# EAGLE schematic CriCri-electrical-diagram (EAGLE 7.2.0)

## Sheet 1 of 2
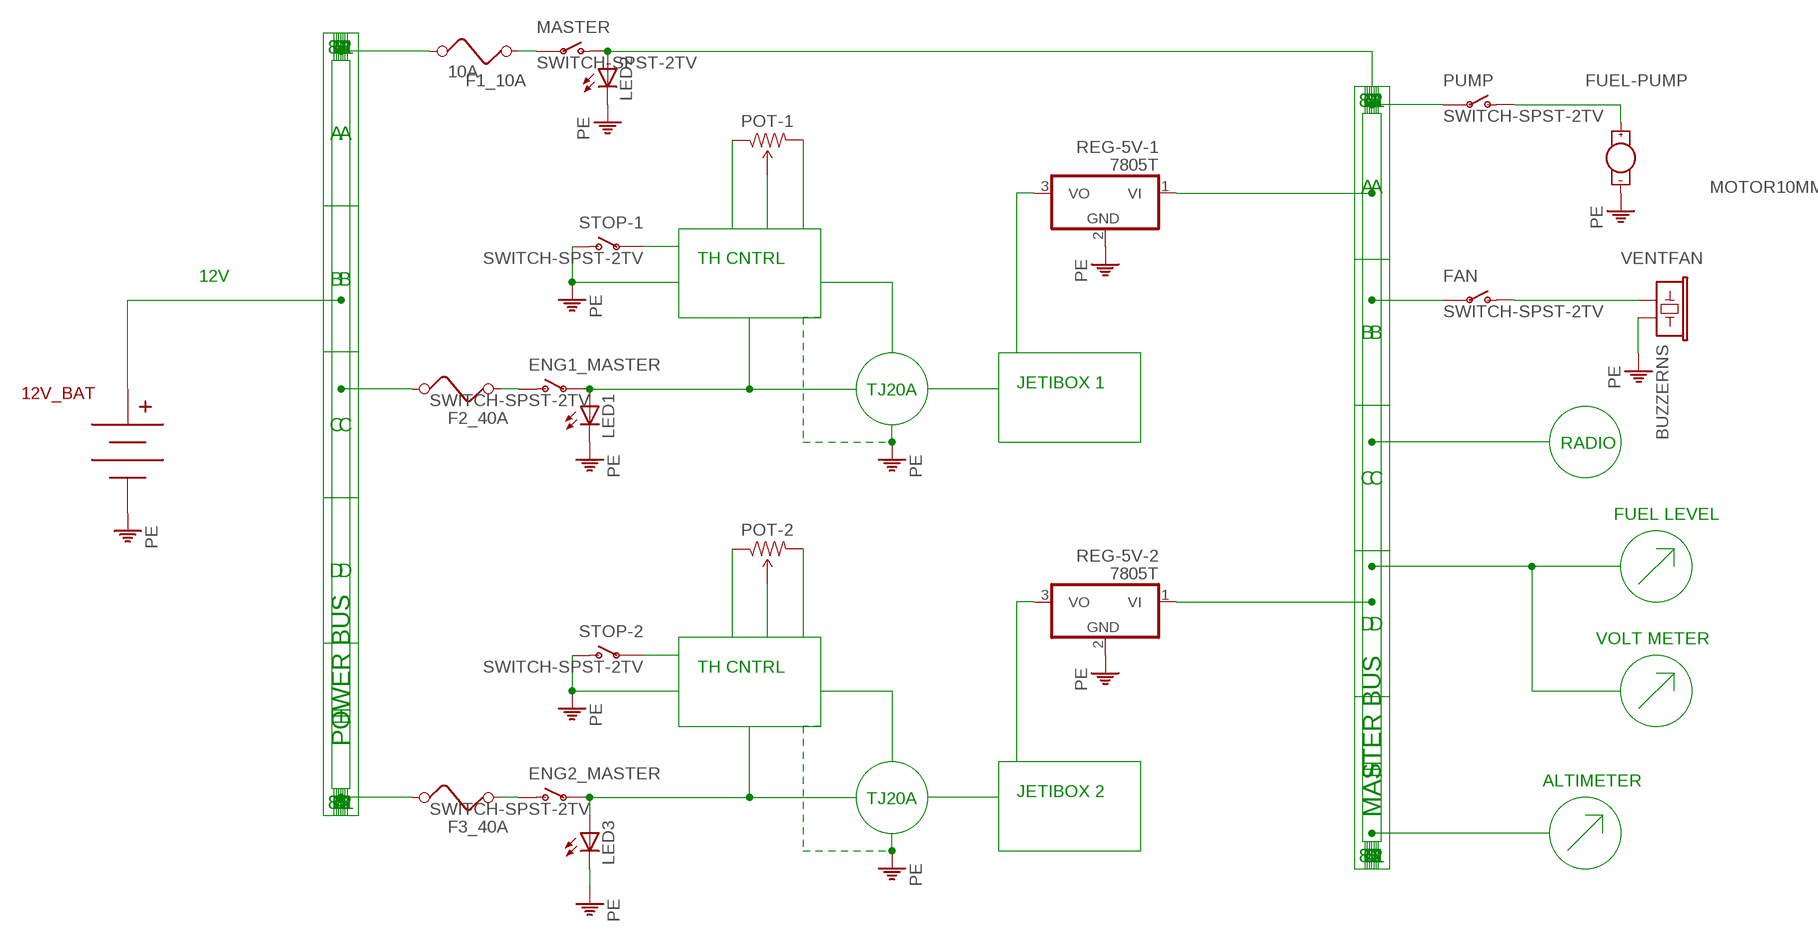
[diagram p0: schematic, sheet 1]

### Parts
12V_BAT  BC9VPC  [BC9VPC]
ENG1_MASTER  SWITCH-SPST-2TV  [SWITCH-SPST-VERTICAL]
ENG2_MASTER  SWITCH-SPST-2TV  [SWITCH-SPST-VERTICAL]
F1_10A  10A  FUSE  [FUSE]
F2_40A  FUSE  [FUSE]
F3_40A  FUSE  [FUSE]
FAN  SWITCH-SPST-2TV  [SWITCH-SPST-VERTICAL]
FUEL-PUMP  MOTOR10MM  [VIBE-MOTOR-10MM]
LED1  LEDB155  [Q62902-B155]
LED2  LEDB155  [Q62902-B155]
LED3  LEDB155  [Q62902-B155]
MASTER  SWITCH-SPST-2TV  [SWITCH-SPST-VERTICAL]
POT-1  TRIMPOT  [TRIMPOT-5MM-V2]
POT-2  TRIMPOT  [TRIMPOT-5MM-V2]
PUMP  SWITCH-SPST-2TV  [SWITCH-SPST-VERTICAL]
REG-5V-1  7805T  [TO220H]
REG-5V-2  7805T  [TO220H]
STOP-1  SWITCH-SPST-2TV  [SWITCH-SPST-VERTICAL]
STOP-2  SWITCH-SPST-2TV  [SWITCH-SPST-VERTICAL]
VENTFAN  BUZZERNS  [BUZZER-12MM-NS]

### Nets
N$1: F1_10A.2 MASTER.2(P)
N$2: REG-5V-1.3(VO)
N$3: FUEL-PUMP.+ PUMP.1(O)
N$4: FAN.1(O) VENTFAN.+
N$5: ENG1_MASTER.1(O) F2_40A.2
N$6: POT-1.B(WIPER) POT-1.C(CW)
N$7: REG-5V-2.3(VO)
N$8: POT-1.A(CCW)
N$14: 12V_BAT.V+
N$16: STOP-1.2(P)
N$17: ENG1_MASTER.2(P) LED1.A
N$18: LED2.A MASTER.1(O)
N$20: ENG2_MASTER.1(O) F3_40A.2
N$21: POT-2.B(WIPER) POT-2.C(CW)
N$22: POT-2.A(CCW)
N$23: STOP-2.2(P)
N$25: REG-5V-2.1(VI)
N$27: ENG2_MASTER.2(P) LED3.A
N$28: FAN.2(P)
N$30: REG-5V-1.1(VI)
N$31: PUMP.2(P)
N$37: F2_40A.1
N$38: F1_10A.1
PE: 12V_BAT.V- FUEL-PUMP.- LED1.K(C) LED2.K(C) LED3.K(C) REG-5V-1.2(GND) REG-5V-2.2(GND) STOP-1.1(O) STOP-2.1(O) VENTFAN.- ; also sheet 2
VCC2: F3_40A.1

### Notes on the sheet
- TH CNTRL
- 12V
- JETIBOX 1
- TJ20A
- RADIO
- FUEL LEVEL
- VOLT METER
- TH CNTRL
- POWER BUS
- ALTIMETER
- JETIBOX 2
- TJ20A
- MASTER BUS

## Sheet 2 of 2
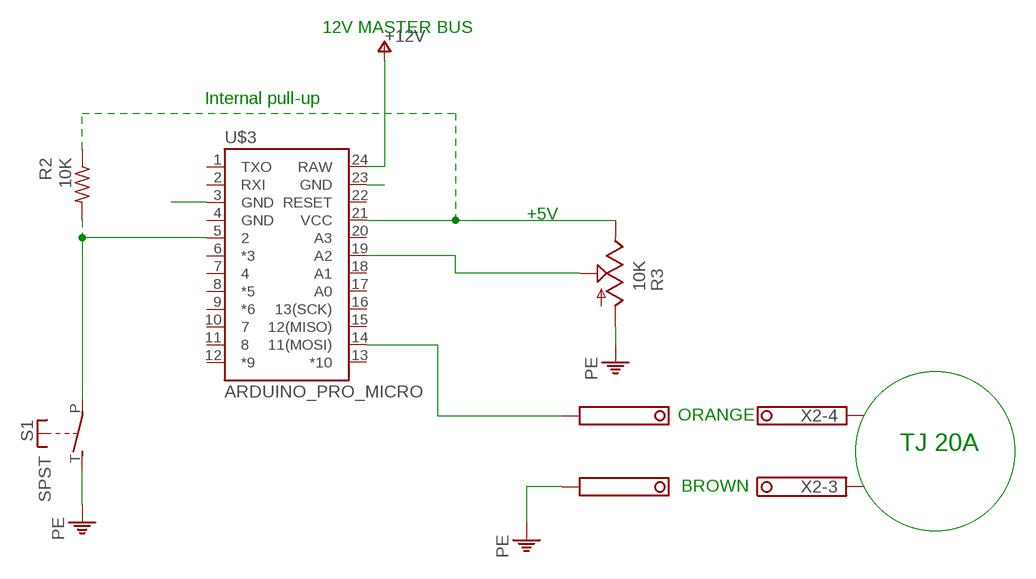
[diagram p1: schematic, sheet 2]

### Parts
R2  10K  R-US_0207/10  [0207/10]
R3  10K  TRIM_US-B25V  [B25V]
S1  SPST  [JUDCOSPST]
U$3  ARDUINO_PRO_MICRO  [ARDUINO_PRO_MICRO]
X1  1751277  [1751277]
X2  1751277  [1751277]

### Nets
GND [GND]: U$3.3(GND) X1.5 ; supply symbol labelled PE
N$9: R2.2 S1.P U$3.5
N$10: R3.S U$3.19(A2)
N$11: U$3.14(11(MOSI)) X1.1
N$12: U$3.23(GND)
N$13: R2.1 R3.E U$3.21(VCC)
PE: R3.A S1.T(S) ; also sheet 1
V+: U$3.24(RAW) ; supply symbol labelled +12V
Unconnected: U$3.1(TXO) U$3.2(RXI) U$3.4(GND) U$3.6(*3) U$3.7 U$3.8(*5) U$3.9(*6) U$3.10 U$3.11 U$3.12(*9) U$3.13(*10) U$3.15(12(MISO)) U$3.16(13(SCK)) U$3.17(A0) U$3.18(A1) U$3.20(A3) U$3.22(RESET) X1.2 X1.3 X1.4 X2.1 X2.2 X2.3 X2.4 X2.5

### Notes on the sheet
- 12V MASTER BUS
- Internal pull-up
- +5V
- ORANGE
- TJ 20A
- BROWN

## Library data of the parts
12V_BAT = SparkFun-Connectors:BC9VPC: 9V board-mount battery cradle; PROD_ID: BATT-10855
ENG1_MASTER ENG2_MASTER FAN MASTER PUMP STOP-1 STOP-2 = SparkFun-Electromechanical:SWITCH-SPST-2
F1_10A F2_40A F3_40A = special:FUSE: FUSE 5 x 20 mm
FUEL-PUMP = SparkFun-Electromechanical:MOTOR: Vibration Motor- ROB-08449 Physical dimension and wire connections for this powerful vibration motor. Motor has a self adhesive backing.
LED1-LED3 = adafruit:LED: LED OSRAM: - CHIPLED LG R971, LG N971, LY N971, LG Q971, LY Q971, LO R971, LY R971 LH N974, LH R974 LS Q976, LO Q976, LY Q976 LO Q996 - Hyper CHIPLED LW Q18S LB Q993, LB Q99A, LB R99A - SideLED LS A670, LO A670, LY A670, LG A670, LP A670 LB A673, LV A673, LT A673, LW A673 LH A674 LY A675 LS A676, LA A676, LO A676, LY A676, LW A676 LS A679, LY A679, LG A679 - Hyper Micro SIDELED® LS Y876, LA Y876, LO Y876, LY Y876 LT Y87S - SmartLED LW L88C, LW L88S LB L89C, LB L89S, LG L890 LS L89K, LO L89K, LY L89K LS L896, LA L896, LO L896, LY L896 - TOPLED LS T670, LO T670, LY T670, LG T670, LP T670 LSG T670, LSP T670, LSY T670, LOP T670, LYG T670 LG T671, LOG T671, LSG T671 LB T673, LV T673, LT T673, LW T673 LH T674 LS T676, LA T676, LO T676, LY T676, LB T676, LH T676, LSB T676, LW T676 LB T67C, LV T67C, LT T67C, LS T67K, LO T67K, LY T67K, LW E67C LS E67B, LA E67B, LO E67B, LY E67B, LB E67C, LV E67C, LT E67C LW T67C LS T679, LY T679, LG T679 LS T770, LO T770, LY T770, LG T770, LP T770 LB T773, LV T773, LT T773, LW T773 LH T774 LS E675, LA E675, LY E675, LS T675 LS T776, LA T776, LO T776, LY T776, LB T776 LHGB T686 LT T68C, LB T68C - Hyper Mini TOPLED® LB M676 - Mini TOPLED Santana® LG M470 LS M47K, LO M47K, LY M47K Source: http://www.osram.convergy.de/
POT-1 POT-2 = SparkFun-Electromechanical:TRIMPOT: Various small potentiometers for "set-and-forget" applications
R2 = resistor:R-US_: RESISTOR, American symbol
R3 = pot:TRIM_US-: POTENTIOMETER
REG-5V-1 REG-5V-2 = linear:78*: Positive VOLTAGE REGULATOR Source: http://cache.national.com/ds/LM/LM78L05.pdf http://www.fairchildsemi.com/ds/LM/LM7805.pdf
S1 = adafruit:SPST: Judco 50-0015-00
U$3 = SparkFun-Boards:ARDUINO_PRO_MICRO
VENTFAN = SparkFun-Electromechanical:BUZZER: Buzzer 12mm Spark Fun Electronics SKU : Comp-Buzzer
X1 X2 = con-phoenix-350:1751277: MKDS 1/ 5-3,5 Printklemme Nennstrom: 10 A Bemessungsspannung: 160 V Raster: 3,5 mm Polzahl: 5 Montageart: Löten Anschlussart: Schraubanschluss Anschlussrichtung vom Leiter zur Platine: 0° Source: http://eshop.phoenixcontact.com .. 1751277.pdf; OC_FARNELL: unknown; OC_NEWARK: unknown

## Module PWM
Ports: TH(io) PWM(io) GND(io) +12V(io)
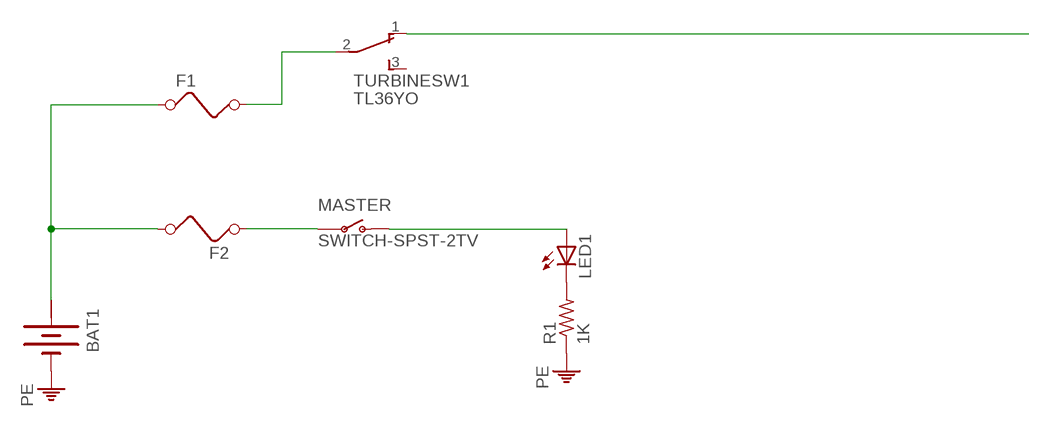
[diagram p2: schematic, module PWM, sheet 1]

### Parts
BAT1  BATTERY  [BATTERY]
F1  FUSE  [FUSE]
F2  FUSE  [FUSE]
LED1  LEDB155  [Q62902-B155]
MASTER  SWITCH-SPST-2TV  [SWITCH-SPST-VERTICAL]
R1  1K  R-US_0204/2V  [0204V]
TURBINESW1  TL36YO  [TL3XYO]

### Nets
N$1: F1.2 TURBINESW1.2(P)
N$2: TURBINESW1.1(O)
N$3: LED1.K(C) R1.2
N$4: F2.1 MASTER.2(P)
N$5: LED1.A MASTER.1(O)
N$6: BAT1.+ F1.1 F2.2
PE: BAT1.- R1.1
Unconnected: TURBINESW1.3(S)

### Power pins joined to a net without a drawn wire
+: BAT1.+@1(+)

### Library data of the parts
BAT1 = special:BATTERY: BATTERY
F1 F2 = special:FUSE: FUSE 5 x 20 mm
LED1 = adafruit:LED: LED OSRAM: - CHIPLED LG R971, LG N971, LY N971, LG Q971, LY Q971, LO R971, LY R971 LH N974, LH R974 LS Q976, LO Q976, LY Q976 LO Q996 - Hyper CHIPLED LW Q18S LB Q993, LB Q99A, LB R99A - SideLED LS A670, LO A670, LY A670, LG A670, LP A670 LB A673, LV A673, LT A673, LW A673 LH A674 LY A675 LS A676, LA A676, LO A676, LY A676, LW A676 LS A679, LY A679, LG A679 - Hyper Micro SIDELED® LS Y876, LA Y876, LO Y876, LY Y876 LT Y87S - SmartLED LW L88C, LW L88S LB L89C, LB L89S, LG L890 LS L89K, LO L89K, LY L89K LS L896, LA L896, LO L896, LY L896 - TOPLED LS T670, LO T670, LY T670, LG T670, LP T670 LSG T670, LSP T670, LSY T670, LOP T670, LYG T670 LG T671, LOG T671, LSG T671 LB T673, LV T673, LT T673, LW T673 LH T674 LS T676, LA T676, LO T676, LY T676, LB T676, LH T676, LSB T676, LW T676 LB T67C, LV T67C, LT T67C, LS T67K, LO T67K, LY T67K, LW E67C LS E67B, LA E67B, LO E67B, LY E67B, LB E67C, LV E67C, LT E67C LW T67C LS T679, LY T679, LG T679 LS T770, LO T770, LY T770, LG T770, LP T770 LB T773, LV T773, LT T773, LW T773 LH T774 LS E675, LA E675, LY E675, LS T675 LS T776, LA T776, LO T776, LY T776, LB T776 LHGB T686 LT T68C, LB T68C - Hyper Mini TOPLED® LB M676 - Mini TOPLED Santana® LG M470 LS M47K, LO M47K, LY M47K Source: http://www.osram.convergy.de/
MASTER = SparkFun-Electromechanical:SWITCH-SPST-2
R1 = resistor:R-US_: RESISTOR, American symbol
TURBINESW1 = switch:TL36YO: TINY SWITCH ON - ON Source: http://www2.produktinfo.conrad.com/datenblaetter/700000-724999/705152-da-01-de-Subminiaturschalter_TL_36YO.pdf

## Net classes
1 PWR: width 1.27 mm
2 GND: width 1.27 mm